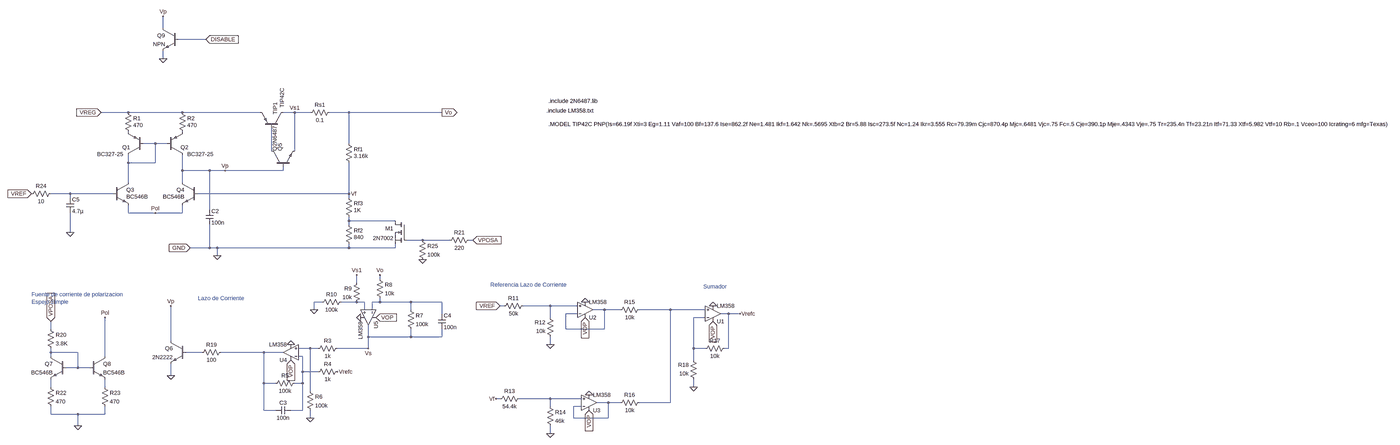
[diagram p0: schematic LDOA.asc, whole sheet]
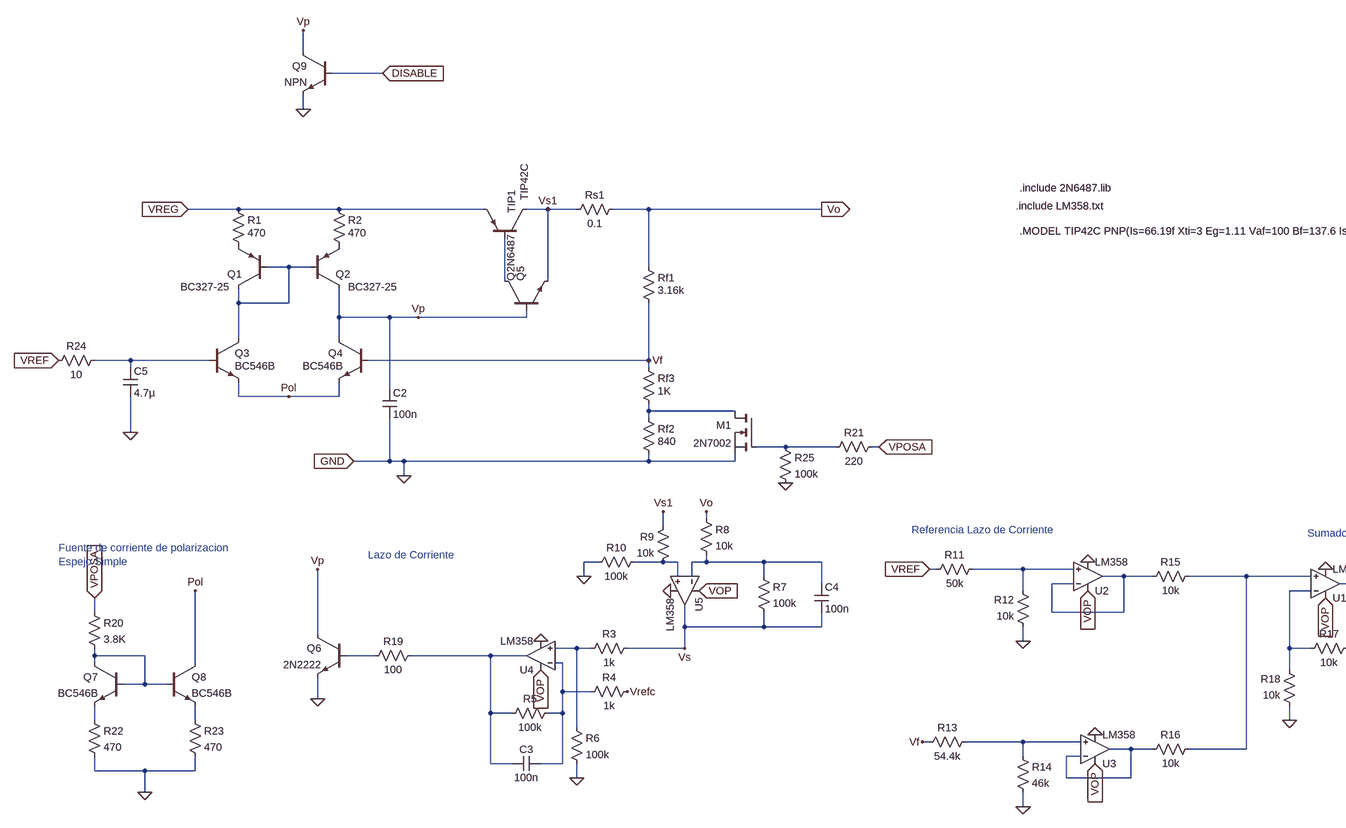
[diagram p1: schematic LDOA.asc, part, row 1 of 1, column 1 of 2]
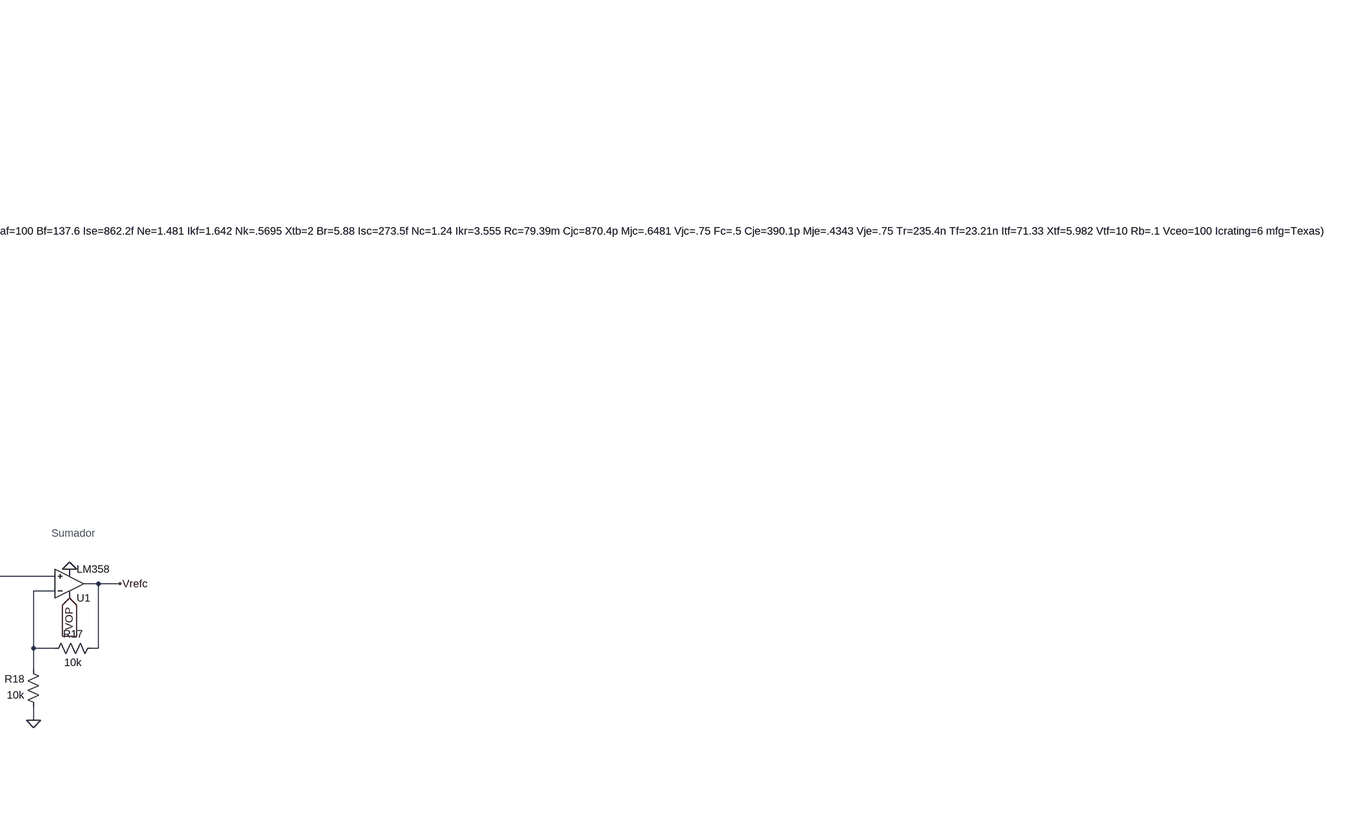
[diagram p2: schematic LDOA.asc, part, row 1 of 1, column 2 of 2]
LDOA.asc, the LTspice schematic file:
Version 4
SHEET 1 4520 772
WIRE -928 -928 -928 -976
WIRE -752 -880 -864 -880
WIRE -928 -800 -928 -832
WIRE -1072 -576 -1184 -576
WIRE -848 -576 -1072 -576
WIRE -528 -576 -848 -576
WIRE -384 -576 -432 -576
WIRE -320 -576 -384 -576
WIRE -160 -576 -240 -576
WIRE 224 -576 -160 -576
WIRE -960 -448 -1008 -448
WIRE -912 -448 -960 -448
WIRE -160 -448 -160 -576
WIRE -480 -416 -480 -512
WIRE -384 -416 -384 -576
WIRE -1072 -368 -1072 -400
WIRE -960 -368 -960 -448
WIRE -960 -368 -1072 -368
WIRE -848 -336 -848 -400
WIRE -736 -336 -848 -336
WIRE -672 -336 -736 -336
WIRE -432 -336 -432 -352
WIRE -432 -336 -672 -336
WIRE -1072 -288 -1072 -368
WIRE -848 -288 -848 -336
WIRE -1312 -240 -1392 -240
WIRE -1136 -240 -1312 -240
WIRE -160 -240 -160 -368
WIRE -160 -240 -784 -240
WIRE -1312 -224 -1312 -240
WIRE -160 -224 -160 -240
WIRE -736 -176 -736 -336
WIRE -1072 -160 -1072 -192
WIRE -960 -160 -1072 -160
WIRE -848 -160 -848 -192
WIRE -848 -160 -960 -160
WIRE -160 -128 -160 -144
WIRE 32 -128 -160 -128
WIRE -160 -112 -160 -128
WIRE -1312 -80 -1312 -160
WIRE 144 -48 80 -48
WIRE 256 -48 144 -48
WIRE 352 -48 336 -48
WIRE -736 -16 -736 -112
WIRE -736 -16 -816 -16
WIRE -704 -16 -736 -16
WIRE -160 -16 -160 -32
WIRE -160 -16 -704 -16
WIRE 32 -16 32 -32
WIRE 32 -16 -160 -16
WIRE -704 16 -704 -16
WIRE -32 112 -32 96
WIRE -128 128 -128 96
WIRE -272 208 -304 208
WIRE -128 208 -192 208
WIRE -96 208 -128 208
WIRE -32 208 -32 192
WIRE -32 208 -64 208
WIRE 96 208 -32 208
WIRE 224 208 96 208
WIRE 480 224 464 224
WIRE 672 224 560 224
WIRE 784 224 672 224
WIRE -304 240 -304 208
WIRE -96 240 -96 208
WIRE -64 240 -64 208
WIRE 96 240 96 208
WIRE 896 240 848 240
WIRE 960 240 896 240
WIRE 1168 240 1040 240
WIRE 1312 240 1168 240
WIRE 224 256 224 208
WIRE 784 256 736 256
WIRE 1408 256 1376 256
WIRE 1456 256 1408 256
WIRE 672 272 672 224
WIRE 1312 272 1264 272
WIRE -1392 320 -1392 288
WIRE 736 320 736 256
WIRE 896 320 896 240
WIRE 896 320 736 320
WIRE -80 352 -80 304
WIRE 96 352 96 320
WIRE 96 352 -80 352
WIRE 224 352 224 320
WIRE 224 352 96 352
WIRE -896 368 -896 224
WIRE 672 384 672 352
WIRE -320 400 -368 400
WIRE -288 400 -320 400
WIRE -80 400 -80 352
WIRE -80 400 -208 400
WIRE 1264 400 1264 272
WIRE 1312 400 1264 400
WIRE 1408 400 1408 256
WIRE 1408 400 1392 400
WIRE -1392 416 -1392 400
WIRE -1280 416 -1392 416
WIRE -768 416 -832 416
WIRE -512 416 -688 416
WIRE -432 416 -512 416
WIRE -1392 432 -1392 416
WIRE -1168 432 -1168 272
WIRE -352 432 -368 432
WIRE 1264 448 1264 400
WIRE -1280 480 -1280 416
WIRE -1280 480 -1328 480
WIRE -1232 480 -1280 480
WIRE -352 496 -352 432
WIRE -288 496 -352 496
WIRE -896 512 -896 464
WIRE -512 544 -512 416
WIRE -464 544 -512 544
WIRE -352 544 -352 496
WIRE -352 544 -384 544
WIRE -1392 560 -1392 528
WIRE -1168 560 -1168 528
WIRE 1264 560 1264 528
WIRE -320 576 -320 400
WIRE 464 608 448 608
WIRE 672 608 544 608
WIRE 800 608 672 608
WIRE 912 624 864 624
WIRE 960 624 912 624
WIRE 1168 624 1168 240
WIRE 1168 624 1040 624
WIRE 672 640 672 608
WIRE 800 640 768 640
WIRE -512 656 -512 544
WIRE -464 656 -512 656
WIRE -352 656 -352 544
WIRE -352 656 -400 656
WIRE -1392 672 -1392 640
WIRE -1280 672 -1392 672
WIRE -1168 672 -1168 640
WIRE -1168 672 -1280 672
WIRE -320 688 -320 656
WIRE 768 688 768 640
WIRE 912 688 912 624
WIRE 912 688 768 688
WIRE -1280 720 -1280 672
WIRE 672 752 672 720
FLAG -704 16 0
FLAG -160 -240 Vf
FLAG -384 -576 Vs1
FLAG -320 688 0
FLAG -208 496 Vrefc
FLAG -304 240 0
FLAG 1264 560 0
FLAG 672 752 0
FLAG 672 384 0
FLAG 1456 256 Vrefc
FLAG -80 400 Vs
FLAG -896 512 0
FLAG -960 -160 Pol
FLAG -1168 272 Pol
FLAG -1280 720 0
FLAG -128 96 Vs1
FLAG -32 96 Vo
FLAG 448 608 Vf
FLAG 1344 224 0
FLAG 816 208 0
FLAG 832 592 0
FLAG -400 384 0
FLAG -112 272 0
FLAG -1312 -80 0
FLAG -896 224 Vp
FLAG -672 -336 Vp
FLAG -1472 -240 VREF
IOPIN -1472 -240 In
FLAG 464 224 VREF
IOPIN 464 224 In
FLAG -1392 288 VPOSA
IOPIN -1392 288 In
FLAG -48 272 VOP
IOPIN -48 272 In
FLAG -400 448 VOP
IOPIN -400 448 In
FLAG 816 272 VOP
IOPIN 816 272 In
FLAG 832 656 VOP
IOPIN 832 656 In
FLAG 1344 288 VOP
IOPIN 1344 288 In
FLAG -1184 -576 VREG
IOPIN -1184 -576 In
FLAG -816 -16 GND
IOPIN -816 -16 In
FLAG 224 -576 Vo
IOPIN 224 -576 Out
FLAG -928 -976 Vp
FLAG -752 -880 DISABLE
IOPIN -752 -880 In
FLAG 144 32 0
FLAG -928 -800 0
FLAG 352 -48 VPOSA
IOPIN 352 -48 In
DATAFLAG 80 -576 ""
SYMBOL pnp -1008 -400 R180
WINDOW 3 84 4 Left 2
SYMATTR Value BC327-25
SYMATTR InstName Q1
SYMBOL pnp -912 -400 M180
WINDOW 3 84 4 Left 2
SYMATTR Value BC327-25
SYMATTR InstName Q2
SYMBOL npn -1136 -288 R0
WINDOW 3 56 60 Left 2
SYMATTR Value BC546B
SYMATTR InstName Q3
SYMBOL npn -784 -288 M0
WINDOW 3 56 60 Left 2
SYMATTR Value BC546B
SYMATTR InstName Q4
SYMBOL pnp -432 -512 M270
WINDOW 3 84 4 Left 2
SYMATTR Value TIP42C
SYMATTR InstName TIP1
SYMBOL npn -480 -352 R270
WINDOW 3 65 14 Left 2
WINDOW 0 64 36 Left 2
SYMATTR Value Q2N6487
SYMATTR InstName Q5
SYMBOL res -176 -464 R0
WINDOW 3 36 68 Left 2
SYMATTR Value 3.16k
SYMATTR InstName Rf1
SYMBOL res -176 -128 R0
WINDOW 3 36 68 Left 2
SYMATTR Value 840
SYMATTR InstName Rf2
SYMBOL res -1088 -592 R0
WINDOW 3 36 68 Left 2
SYMATTR Value 470
SYMATTR InstName R1
SYMBOL res -864 -592 R0
WINDOW 3 36 68 Left 2
SYMATTR Value 470
SYMATTR InstName R2
SYMBOL res -224 -592 R90
WINDOW 0 0 56 VBottom 2
WINDOW 3 32 56 VTop 2
SYMATTR InstName Rs1
SYMATTR Value 0.1
SYMBOL res -192 384 R90
WINDOW 0 0 56 VBottom 2
WINDOW 3 32 56 VTop 2
SYMATTR InstName R3
SYMATTR Value 1k
SYMBOL res -192 480 R90
WINDOW 0 0 56 VBottom 2
WINDOW 3 32 56 VTop 2
SYMATTR InstName R4
SYMATTR Value 1k
SYMBOL res -368 528 R90
WINDOW 0 0 56 VBottom 2
WINDOW 3 32 56 VTop 2
SYMATTR InstName R5
SYMATTR Value 100k
SYMBOL res -336 560 R0
SYMATTR InstName R6
SYMATTR Value 100k
SYMBOL npn -832 368 M0
SYMATTR InstName Q6
SYMATTR Value 2N2222
SYMBOL res 80 224 R0
SYMATTR InstName R7
SYMATTR Value 100k
SYMBOL res -48 96 R0
SYMATTR InstName R8
SYMATTR Value 10k
SYMBOL res -112 112 M0
SYMATTR InstName R9
SYMATTR Value 10k
SYMBOL res -176 192 R90
WINDOW 0 0 56 VBottom 2
WINDOW 3 32 56 VTop 2
SYMATTR InstName R10
SYMATTR Value 100k
SYMBOL res 576 208 R90
WINDOW 0 0 56 VBottom 2
WINDOW 3 32 56 VTop 2
SYMATTR InstName R11
SYMATTR Value 50k
SYMBOL res 688 368 R180
WINDOW 0 36 76 Left 2
WINDOW 3 36 40 Left 2
SYMATTR InstName R12
SYMATTR Value 10k
SYMBOL res 448 624 R270
WINDOW 0 32 56 VTop 2
WINDOW 3 0 56 VBottom 2
SYMATTR InstName R13
SYMATTR Value 54.4k
SYMBOL res 656 624 R0
SYMATTR InstName R14
SYMATTR Value 46k
SYMBOL res 1056 224 R90
WINDOW 0 0 56 VBottom 2
WINDOW 3 32 56 VTop 2
SYMATTR InstName R15
SYMATTR Value 10k
SYMBOL res 1056 608 R90
WINDOW 0 0 56 VBottom 2
WINDOW 3 32 56 VTop 2
SYMATTR InstName R16
SYMATTR Value 10k
SYMBOL res 1408 384 R90
WINDOW 0 0 56 VBottom 2
WINDOW 3 32 56 VTop 2
SYMATTR InstName R17
SYMATTR Value 10k
SYMBOL res 1280 544 R180
WINDOW 0 36 76 Left 2
WINDOW 3 36 40 Left 2
SYMATTR InstName R18
SYMATTR Value 10k
SYMBOL res -176 -240 R0
WINDOW 3 36 68 Left 2
SYMATTR Value 1K
SYMATTR InstName Rf3
SYMBOL res -672 400 R90
WINDOW 0 0 56 VBottom 2
WINDOW 3 32 56 VTop 2
SYMATTR InstName R19
SYMATTR Value 100
SYMBOL npn -1328 432 M0
SYMATTR InstName Q7
SYMATTR Value BC546B
SYMBOL res -1408 304 R0
SYMATTR InstName R20
SYMATTR Value 3.8K
SYMBOL npn -1232 432 R0
SYMATTR InstName Q8
SYMATTR Value BC546B
SYMBOL cap -752 -176 R0
SYMATTR InstName C2
SYMATTR Value 100n
SYMBOL Opamps\\opamp2 1344 320 M180
SYMATTR InstName U1
SYMATTR Value LM358
SYMBOL Opamps\\opamp2 816 304 M180
SYMATTR InstName U2
SYMATTR Value LM358
SYMBOL Opamps\\opamp2 832 688 M180
SYMATTR InstName U3
SYMATTR Value LM358
SYMBOL Opamps\\opamp2 -400 480 R180
SYMATTR InstName U4
SYMATTR Value LM358
SYMBOL Opamps\\opamp2 -16 272 R90
SYMATTR InstName U5
SYMATTR Value LM358
SYMBOL res -1408 544 R0
SYMATTR InstName R22
SYMATTR Value 470
SYMBOL res -1184 544 R0
SYMATTR InstName R23
SYMATTR Value 470
SYMBOL cap -400 640 R90
WINDOW 0 0 32 VBottom 2
WINDOW 3 32 32 VTop 2
SYMATTR InstName C3
SYMATTR Value 100n
SYMBOL cap 208 256 R0
SYMATTR InstName C4
SYMATTR Value 100n
SYMBOL res -1376 -256 R90
WINDOW 0 0 56 VBottom 2
WINDOW 3 32 56 VTop 2
SYMATTR InstName R24
SYMATTR Value 10
SYMBOL cap -1328 -224 R0
SYMATTR InstName C5
SYMATTR Value 4.7µ
SYMBOL nmos 80 -128 M0
SYMATTR InstName M1
SYMATTR Value 2N7002
SYMBOL res 352 -64 R90
WINDOW 0 0 56 VBottom 2
WINDOW 3 32 56 VTop 2
SYMATTR InstName R21
SYMATTR Value 220
SYMBOL res 128 -64 R0
SYMATTR InstName R25
SYMATTR Value 100k
SYMBOL npn -864 -928 M0
SYMATTR InstName Q9
TEXT -784 192 Left 2 ;Lazo de Corriente
TEXT 424 136 Left 2 ;Referencia Lazo de Corriente
TEXT 1304 144 Left 2 ;Sumador
TEXT -1472 176 Left 2 ;Fuente de corriente de polarizacion\nEspejo Simple
TEXT 656 -584 Left 2 !.include LM358.txt
TEXT 664 -528 Left 2 !.MODEL TIP42C PNP(Is=66.19f Xti=3 Eg=1.11 Vaf=100 Bf=137.6 Ise=862.2f Ne=1.481 Ikf=1.642 Nk=.5695 Xtb=2 Br=5.88 Isc=273.5f Nc=1.24 Ikr=3.555 Rc=79.39m Cjc=870.4p Mjc=.6481 Vjc=.75 Fc=.5 Cje=390.1p Mje=.4343 Vje=.75 Tr=235.4n Tf=23.21n Itf=71.33 Xtf=5.982 Vtf=10 Rb=.1 Vceo=100 Icrating=6 mfg=Texas)
TEXT 664 -624 Left 2 !.include 2N6487.lib

The netlist it stands for:
* LDOA.asc
Q1 N001 N001 P001 0 BC327-25
Q2 Vp N001 P002 0 BC327-25
Q3 N001 N003 Pol 0 BC546B
Q4 Vp Vf Pol 0 BC546B
Q§TIP1 Vs1 N002 VREG 0 TIP42C
Q5 N002 Vp Vs1 0 Q2N6487
Rf1 Vo Vf 3.16k
Rf2 N004 0 840
R1 VREG P001 470
R2 VREG P002 470
Rs1 Vo Vs1 0.1
R3 Vs N012 1k
R4 Vrefc N016 1k
R5 N016 N015 100k
R6 N012 0 100k
Q6 Vp N014 0 0 2N2222
R7 N007 Vs 100k
R8 Vo N007 10k
R9 Vs1 N006 10k
R10 N006 0 100k
R11 N008 VREF 50k
R12 0 N008 10k
R13 Vf N019 54.4k
R14 N019 0 46k
R15 N010 N009 10k
R16 N010 N020 10k
R17 Vrefc N011 10k
R18 0 N011 10k
Rf3 Vf N004 1K
R19 N015 N014 100
Q7 N013 N013 N017 0 BC546B
R20 VPOSA N013 3.8K
Q8 Pol N013 N018 0 BC546B
C2 Vp 0 100n
XU1 N010 N011 VOP 0 Vrefc LM358  ; pins In+ In- V+ V- OUT
XU2 N008 N009 VOP 0 N009 LM358  ; pins In+ In- V+ V- OUT
XU3 N019 N020 VOP 0 N020 LM358  ; pins In+ In- V+ V- OUT
XU4 N012 N016 VOP 0 N015 LM358  ; pins In+ In- V+ V- OUT
XU5 N006 N007 VOP 0 Vs LM358  ; pins In+ In- V+ V- OUT
R22 N017 0 470
R23 N018 0 470
C3 N016 N015 100n
C4 N007 Vs 100n
R24 N003 VREF 10
C5 N003 0 4.7µ
M1 N004 N005 0 0 2N7002
R21 VPOSA N005 220
R25 N005 0 100k
Q9 Vp DISABLE 0 0 NPN
.model NPN NPN
.model PNP PNP
.lib standard.bjt
.model NMOS NMOS
.model PMOS PMOS
.lib standard.mos
* Lazo de Corriente
* Referencia Lazo de Corriente
* Sumador
* Fuente de corriente de polarizacion
* Espejo Simple
.include LM358.txt
.MODEL TIP42C PNP(Is=66.19f Xti=3 Eg=1.11 Vaf=100 Bf=137.6 Ise=862.2f Ne=1.481 Ikf=1.642 Nk=.5695 Xtb=2 Br=5.88 Isc=273.5f Nc=1.24 Ikr=3.555 Rc=79.39m Cjc=870.4p Mjc=.6481 Vjc=.75 Fc=.5 Cje=390.1p Mje=.4343 Vje=.75 Tr=235.4n Tf=23.21n Itf=71.33 Xtf=5.982 Vtf=10 Rb=.1 Vceo=100 Icrating=6 mfg=Texas)
.include 2N6487.lib
.backanno
.end